# Altium schematic sheet power.SchDoc
size A; SheetNumber: 5; SheetTotal: 6
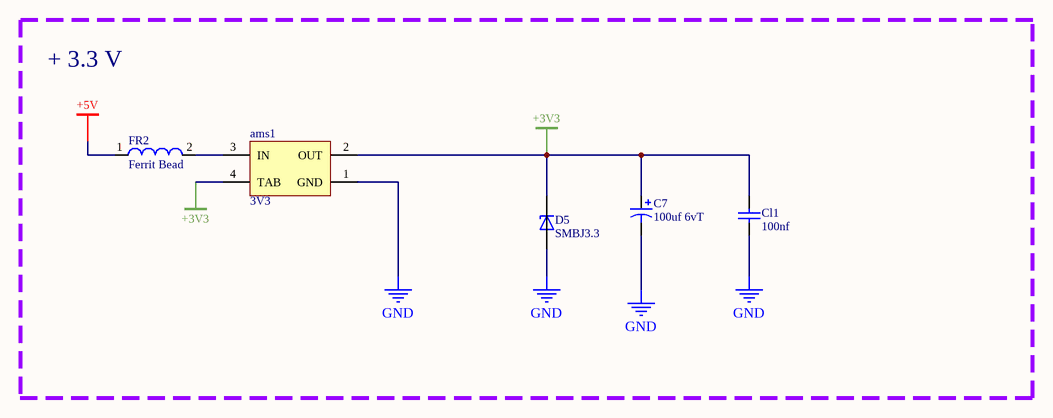
[diagram p0: power.SchDoc]

## Parts
ams1  3V3  [SOT223]
C7  100uf 6vT  [B]
Cl1  100nf  [RES 0603 (1608X06L)]
D5  SMBJ3.3  [DIOM4336X265N]
FR2  Ferrit Bead  [RES 0805 (2012X06L)]

## Blocks framed on the sheet
+ 3.3 V: ams1 C7 Cl1 D5 FR2

## Nets
+3V3: ams1.2(OUT) ams1.4(TAB) C7.1 Cl1.2 D5.C
+5V: FR2.1
GND: ams1.1(GND) C7.2 Cl1.1 D5.A
Netams1_3: ams1.3(IN) FR2.2

## Library data of the parts
ams1 = AMS1117-x.x: x.x Volt, 800mA Low-Dropout Linear Regulator, 4-pin SOT-223; Designer: Ali Hafizi; Data: 16-12-2016
C7 = T494B: Cap/Tantalum/SMD/B; Published: 17-Jul-2002; LatestRevisionDate: 19-Mar-2004; LatestRevisionNote: Silkscreen dimensions re-sized.; DatasheetDocument: Mar-2001; PackageDocument: Mar-2001; PackageReference: B; Publisher: Altium Limited; Code_JEITA: 3528-21; ComponentLink1Description: Manufacturer Link; ComponentLink1URL: http://www.kemet.com/; ComponentLink2Description: Datasheet; ComponentLink2URL: http://www.kemet.com/kemet/web/homepage/kechome.nsf/vapubfilesname/F3102TA.pdf/$file/F3102TA.pdf
Cl1 = CAP SMD 0805: CAP 0805; Designer: Abbas Basereh; Desc.: CAP SMD 0805; Data: 16-12-2016
D5 = SMBJ33: MF: {'manufacturer': u'Taiwan Semiconductor'}; Price: None; Availability: Unavailable; Value: *; MP: SMBJ33; Package: None